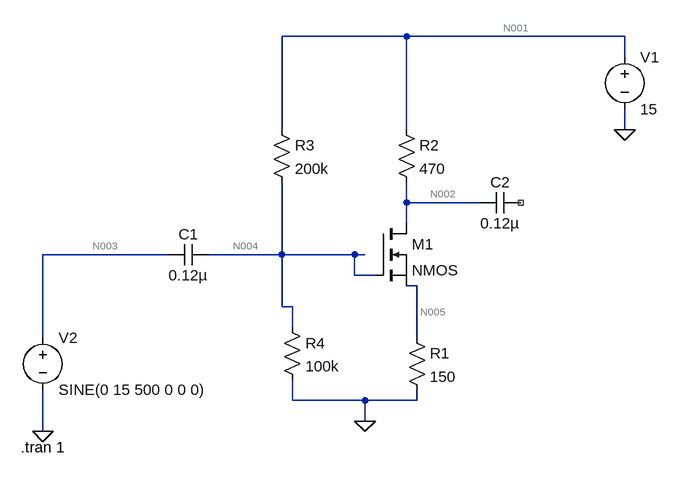
[diagram p0: schematic Draft3.asc]
Draft3.asc, the LTspice schematic file:
Version 4
SHEET 1 880 680
WIRE 224 -128 32 -128
WIRE 560 -128 224 -128
WIRE 560 -96 560 -128
WIRE 32 16 32 -128
WIRE 224 16 224 -128
WIRE 560 16 560 -16
WIRE 224 128 224 96
WIRE 336 128 224 128
WIRE 224 160 224 128
WIRE -144 208 -336 208
WIRE 32 208 32 96
WIRE 32 208 -80 208
WIRE 144 208 32 208
WIRE 160 208 144 208
WIRE 144 240 144 208
WIRE 176 240 144 240
WIRE 240 256 224 256
WIRE 32 288 32 208
WIRE 48 288 32 288
WIRE 48 320 48 288
WIRE -336 336 -336 208
WIRE 240 336 240 256
WIRE 48 432 48 400
WIRE 160 432 48 432
WIRE 240 432 240 416
WIRE 240 432 160 432
WIRE 160 464 160 432
WIRE -336 480 -336 416
FLAG 160 464 0
FLAG 560 16 0
FLAG -336 480 0
SYMBOL res 224 320 R0
SYMATTR InstName R1
SYMATTR Value 150
SYMBOL res 208 0 R0
SYMATTR InstName R2
SYMATTR Value 470
SYMBOL res 16 0 R0
SYMATTR InstName R3
SYMATTR Value 200k
SYMBOL res 32 304 R0
SYMATTR InstName R4
SYMATTR Value 100k
SYMBOL cap -80 192 R90
WINDOW 0 0 32 VBottom 2
WINDOW 3 32 32 VTop 2
SYMATTR InstName C1
SYMATTR Value 0.12µ
SYMBOL cap 400 112 R90
WINDOW 0 0 32 VBottom 2
WINDOW 3 32 32 VTop 2
SYMATTR InstName C2
SYMATTR Value 0.12µ
SYMBOL voltage 560 -112 R0
WINDOW 123 0 0 Left 0
WINDOW 39 0 0 Left 0
SYMATTR InstName V1
SYMATTR Value 15
SYMBOL voltage -336 320 R0
WINDOW 123 0 0 Left 0
WINDOW 39 0 0 Left 0
SYMATTR InstName V2
SYMATTR Value SINE(0 15 500 0 0 0)
SYMBOL nmos 176 160 R0
SYMATTR InstName M1
TEXT -370 504 Left 2 !.tran 1

The netlist it stands for:
* Draft3.asc
R1 N005 0 150
R2 N001 N002 470
R3 N001 N004 200k
R4 N004 0 100k
C1 N004 N003 0.12µ
C2 NC_01 N002 0.12µ
V1 N001 0 15
V2 N003 0 SINE(0 15 500 0 0 0)
M1 N002 N004 N005 N005 NMOS
.model NMOS NMOS
.model PMOS PMOS
.lib standard.mos
.tran 1
.backanno
.end

* Results of the author's LTspice run, read from the files saved beside the schematic
* Operating Point, zero values left out:
*   V(n005) = 36.95 mV
*   V(n001) = 15 V
*   V(n002) = 14.88 V
*   V(n004) = 5 V
*   Id(M1) = 246.3 µA
*   Ib(M1) = -14.86 pA
*   Is(M1) = -246.3 µA
*   I(R4) = 50 µA
*   I(R3) = 50 µA
*   I(R2) = 246.3 µA
*   I(R1) = 246.3 µA
*   I(V1) = -296.3 µA
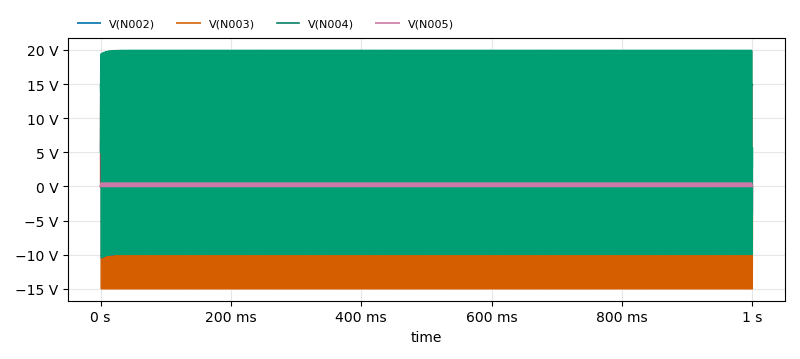
[diagram p1: Transient Analysis of Draft3.asc, plotted from the saved traces]
* Transient Analysis, 1 run:
*   V(N002): min 13.42 V, max 15 V, average 14.46 V, rms 14.48 V, last 14.86 V
*   V(N003): min -14.99 V, max 14.99 V, average 9.414 µV, rms 10.78 V, last 0 V
*   V(N004): min -10.44 V, max 19.95 V, average 4.995 V, rms 11.7 V, last 5.59 V
*   V(N005): min 0 V, max 503.2 mV, average 170.8 mV, rms 252.1 mV, last 46.11 mV